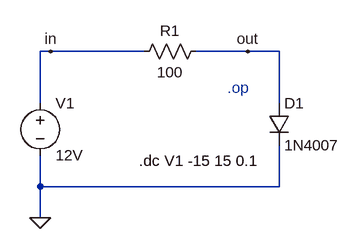
[diagram p0: schematic Assignment_2.6.asc]
Assignment_2.6.asc, the LTspice schematic file:
Version 4.1
SHEET 1 880 680
WIRE 64 48 48 48
WIRE 208 48 64 48
WIRE 368 48 288 48
WIRE 416 48 368 48
WIRE 48 128 48 48
WIRE 416 128 416 48
WIRE 48 256 48 208
WIRE 416 256 416 192
WIRE 416 256 48 256
WIRE 48 304 48 256
FLAG 48 304 0
FLAG 64 48 in
FLAG 368 48 out
SYMBOL voltage 48 112 R0
SYMATTR InstName V1
SYMATTR Value 12V
SYMBOL diode 400 128 R0
SYMATTR InstName D1
SYMATTR Value 1N4007
SYMBOL res 304 32 R90
WINDOW 0 0 56 VBottom 2
WINDOW 3 32 56 VTop 2
SYMATTR InstName R1
SYMATTR Value 100
TEXT 336 104 Left 2 ;.op
TEXT 200 216 Left 2 !.dc V1 -15 15 0.1

The netlist it stands for:
* Assignment_2.6.asc
V1 in 0 12V
D1 out 0 1N4007
R1 out in 100
.model D D
.lib standard.dio
* .op
.dc V1 -15 15 0.1
.backanno
.end